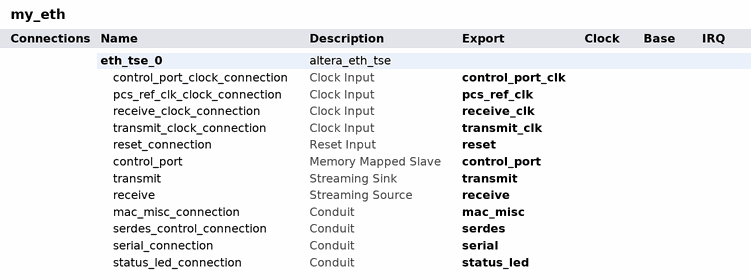
[diagram p0: system contents]
# Platform Designer (Qsys) system my_eth, Arria 10 10AX115S2F45I1SG
# Parameters at their usual value, and those the tool derives, are not listed.
package require -exact qsys 1.0
create_system my_eth
set_project_property DEVICE_FAMILY {Arria 10}
set_project_property DEVICE 10AX115S2F45I1SG

add_component eth_tse_0 ip/my_eth/my_eth_eth_tse_0.ip altera_eth_tse eth_tse_0 17.1
load_component eth_tse_0
set_component_parameter_value isUsePCS_2xTBI false
set_component_parameter_value core_variation MAC_PCS
set_component_parameter_value enable_hidden_features false
set_component_parameter_value ifGMII MII_GMII
set_component_parameter_value transceiver_type LVDS_IO
set_component_parameter_value enable_hd_logic false
set_component_parameter_value stat_cnt_ena true
set_component_parameter_value enable_shift16 true
set_component_parameter_value enable_mac_flow_ctrl true
set_component_parameter_value enable_magic_detect false
set_component_parameter_value useMDIO false
set_component_parameter_value mdio_clk_div 50
set_component_parameter_value ing_addr 11
set_component_parameter_value enable_sgmii true
set_component_parameter_value XCVR_RCFG_JTAG_ENABLE 0
set_component_parameter_value XCVR_SET_CAPABILITY_REG_ENABLE 0
set_component_parameter_value XCVR_SET_USER_IDENTIFIER 0
set_component_parameter_value XCVR_SET_CSR_SOFT_LOGIC_ENABLE 0
set_component_parameter_value XCVR_SET_PRBS_SOFT_LOGIC_ENABLE 0
set_component_parameter_value part_trait_bd NIGHTFURY5
set_component_parameter_value XCVR_TILE htile
set_component_parameter_value nd_phyip_rcfg_enable false
set_component_parameter_value ND_XCVR_RCFG_JTAG_ENABLE 0
set_component_parameter_value ND_XCVR_SET_CAPABILITY_REG_ENABLE 0
set_component_parameter_value ND_XCVR_SET_USER_IDENTIFIER 0
set_component_parameter_value ND_XCVR_SET_CSR_SOFT_LOGIC_ENABLE 0
set_component_parameter_value rcp_load_enable 0
set_component_parameter_value enable_adpt_multi_recipe 1
set_component_parameter_value cal_recipe_sel NRZ_28Gbps_VSR
set_component_parameter_value enable_pma_adpt_disp 0
set_component_parameter_value ctle_lf_val_a 999
set_component_parameter_value ctle_lf_val_ada_a adaptable
set_component_parameter_value ctle_lf_min_a 999
set_component_parameter_value ctle_lf_max_a 999
set_component_parameter_value ctle_hf_val_a 999
set_component_parameter_value ctle_hf_val_ada_a adaptable
set_component_parameter_value ctle_hf_min_a 999
set_component_parameter_value ctle_hf_max_a 999
set_component_parameter_value rf_p2_val_a 999
set_component_parameter_value rf_p2_val_ada_a adaptable
set_component_parameter_value rf_p2_min_a 999
set_component_parameter_value rf_p2_max_a 999
set_component_parameter_value rf_p1_val_a 999
set_component_parameter_value rf_p1_val_ada_a adaptable
set_component_parameter_value rf_p1_min_a 999
set_component_parameter_value rf_p1_max_a 999
set_component_parameter_value rf_reserved0_a 999
set_component_parameter_value rf_p0_val_a 999
set_component_parameter_value rf_p0_val_ada_a adaptable
set_component_parameter_value rf_reserved1_a 999
set_component_parameter_value rf_b0t_a 999
set_component_parameter_value ctle_gs1_val_a 999
set_component_parameter_value ctle_gs2_val_a 999
set_component_parameter_value rf_b1_a 999
set_component_parameter_value rf_b1_ada_a adaptable
set_component_parameter_value rf_b0_a 999
set_component_parameter_value rf_b0_ada_a adaptable
set_component_parameter_value rf_a_a 999
set_component_parameter_value l_ctle_frz_a 999
set_component_parameter_value l_rf_frz_a 999
set_component_parameter_value ctle_lf_val_b 999
set_component_parameter_value ctle_lf_val_ada_b adaptable
set_component_parameter_value ctle_lf_min_b 999
set_component_parameter_value ctle_lf_max_b 999
set_component_parameter_value ctle_hf_val_b 999
set_component_parameter_value ctle_hf_val_ada_b adaptable
set_component_parameter_value ctle_hf_min_b 999
set_component_parameter_value ctle_hf_max_b 999
set_component_parameter_value rf_p2_val_b 999
set_component_parameter_value rf_p2_val_ada_b adaptable
set_component_parameter_value rf_p2_min_b 999
set_component_parameter_value rf_p2_max_b 999
set_component_parameter_value rf_p1_val_b 999
set_component_parameter_value rf_p1_val_ada_b adaptable
set_component_parameter_value rf_p1_min_b 999
set_component_parameter_value rf_p1_max_b 999
set_component_parameter_value rf_reserved0_b 999
set_component_parameter_value rf_p0_val_b 999
set_component_parameter_value rf_p0_val_ada_b adaptable
set_component_parameter_value rf_reserved1_b 999
set_component_parameter_value rf_b0t_b 999
set_component_parameter_value ctle_gs1_val_b 999
set_component_parameter_value ctle_gs2_val_b 999
set_component_parameter_value rf_b1_b 999
set_component_parameter_value rf_b1_ada_b adaptable
set_component_parameter_value rf_b0_b 999
set_component_parameter_value rf_b0_ada_b adaptable
set_component_parameter_value rf_a_b 999
set_component_parameter_value l_ctle_frz_b 999
set_component_parameter_value l_rf_frz_b 999
set_component_parameter_value adpt_multi_enable 1
set_component_parameter_value adpt_recipe_cnt 1
set_component_parameter_value adpt_recipe_select 0
set_component_parameter_value adpt_params ctle_lf_val_a,ctle_lf_val_ada_a,ctle_lf_min_a,ctle_lf_max_a,ctle_hf_val_a,ctle_hf_val_ada_a,ctle_hf_min_a,ctle_hf_max_a,rf_p2_val_a,rf_p2_val_ada_a,rf_p2_min_a,rf_p2_max_a,rf_p1_val_a,rf_p1_val_ada_a,rf_p1_min_a,rf_p1_max_a,rf_reserved0_a,rf_p0_val_a,rf_p0_val_ada_a,rf_reserved1_a,rf_b0t_a,ctle_gs1_val_a,ctle_gs2_val_a,rf_b1_a,rf_b1_ada_a,rf_b0_a,rf_b0_ada_a,rf_a_a,ctle_lf_val_b,ctle_lf_val_ada_b,ctle_lf_min_b,ctle_lf_max_b,ctle_hf_val_b,ctle_hf_val_ada_b,ctle_hf_min_b,ctle_hf_max_b,rf_p2_val_b,rf_p2_val_ada_b,rf_p2_min_b,rf_p2_max_b,rf_p1_val_b,rf_p1_val_ada_b,rf_p1_min_b,rf_p1_max_b,rf_reserved0_b,rf_p0_val_b,rf_p0_val_ada_b,rf_reserved1_b,rf_b0t_b,ctle_gs1_val_b,ctle_gs2_val_b,rf_b1_b,rf_b1_ada_b,rf_b0_b,rf_b0_ada_b,rf_a_b
set_component_parameter_value adpt_params_a ctle_lf_val_a,ctle_lf_val_ada_a,ctle_lf_min_a,ctle_lf_max_a,ctle_hf_val_a,ctle_hf_val_ada_a,ctle_hf_min_a,ctle_hf_max_a,rf_p2_val_a,rf_p2_val_ada_a,rf_p2_min_a,rf_p2_max_a,rf_p1_val_a,rf_p1_val_ada_a,rf_p1_min_a,rf_p1_max_a,rf_reserved0_a,rf_p0_val_a,rf_p0_val_ada_a,rf_reserved1_a,rf_b0t_a,ctle_gs1_val_a,ctle_gs2_val_a,rf_b1_a,rf_b1_ada_a,rf_b0_a,rf_b0_ada_a,rf_a_a
set_component_parameter_value adpt_params_b ctle_lf_val_b,ctle_lf_val_ada_b,ctle_lf_min_b,ctle_lf_max_b,ctle_hf_val_b,ctle_hf_val_ada_b,ctle_hf_min_b,ctle_hf_max_b,rf_p2_val_b,rf_p2_val_ada_b,rf_p2_min_b,rf_p2_max_b,rf_p1_val_b,rf_p1_val_ada_b,rf_p1_min_b,rf_p1_max_b,rf_reserved0_b,rf_p0_val_b,rf_p0_val_ada_b,rf_reserved1_b,rf_b0t_b,ctle_gs1_val_b,ctle_gs2_val_b,rf_b1_b,rf_b1_ada_b,rf_b0_b,rf_b0_ada_b,rf_a_b
set_component_parameter_value adpt_param_labels_a {GAINLF,GAINLF Fix/Adaptable,CTLE LF Min,CTLE LF Max,GAINHF,GAINHF Fix/Adaptable,CTLE HF Min,CTLE HF Max,RF_P2,RF_P2 Fix/Adaptable,RF_P2_MIN,RF_P2_MAX,RF_P1,RF_P1 Fix/Adaptable,RF_P1_MIN,RF_P1_MAX,Reserved 0,RF_P0,RF_P0 Fix/Adaptable,Reserved 1,RF_B0T,GS1,GS2,RF_B1,RF_B1 Fix/Adaptable,RF_B0,RF_B0 Fix/Adaptable,RF_A}
set_component_parameter_value adpt_param_labels_b {GAINLF,GAINLF Fix/Adaptable,CTLE LF Min,CTLE LF Max,GAINHF,GAINHF Fix/Adaptable,CTLE HF Min,CTLE HF Max,RF_P2,RF_P2 Fix/Adaptable,RF_P2_MIN,RF_P2_MAX,RF_P1,RF_P1 Fix/Adaptable,RF_P1_MIN,RF_P1_MAX,Reserved 0,RF_P0,RF_P0 Fix/Adaptable,Reserved 1,RF_B0T,GS1,GS2,RF_B1,RF_B1 Fix/Adaptable,RF_B0,RF_B0 Fix/Adaptable,RF_A}
save_component

# exported interfaces
add_interface control_port avalon slave
set_interface_property control_port EXPORT_OF eth_tse_0.control_port
add_interface control_port_clk clock sink
set_interface_property control_port_clk EXPORT_OF eth_tse_0.control_port_clock_connection
add_interface mac_misc conduit end
set_interface_property mac_misc EXPORT_OF eth_tse_0.mac_misc_connection
add_interface pcs_ref_clk clock sink
set_interface_property pcs_ref_clk EXPORT_OF eth_tse_0.pcs_ref_clk_clock_connection
add_interface receive avalon_streaming source
set_interface_property receive EXPORT_OF eth_tse_0.receive
add_interface receive_clk clock sink
set_interface_property receive_clk EXPORT_OF eth_tse_0.receive_clock_connection
add_interface reset reset sink
set_interface_property reset EXPORT_OF eth_tse_0.reset_connection
add_interface serdes conduit end
set_interface_property serdes EXPORT_OF eth_tse_0.serdes_control_connection
add_interface serial conduit end
set_interface_property serial EXPORT_OF eth_tse_0.serial_connection
add_interface status_led conduit end
set_interface_property status_led EXPORT_OF eth_tse_0.status_led_connection
add_interface transmit avalon_streaming sink
set_interface_property transmit EXPORT_OF eth_tse_0.transmit
add_interface transmit_clk clock sink
set_interface_property transmit_clk EXPORT_OF eth_tse_0.transmit_clock_connection

save_system my_eth.qsys
